# Altium schematic sheet Э2 Jinkono Module Схема электрическая функциональная.SchDoc
size 594 x 420 mm; Author: Гавриленко; CompanyName: OPEN SOURCE; Address1: Address1; Address2: Address2; Address3: Address3; Address4: Address4; SheetTotal: 1; DocumentType: Схема электрическая принципиальная
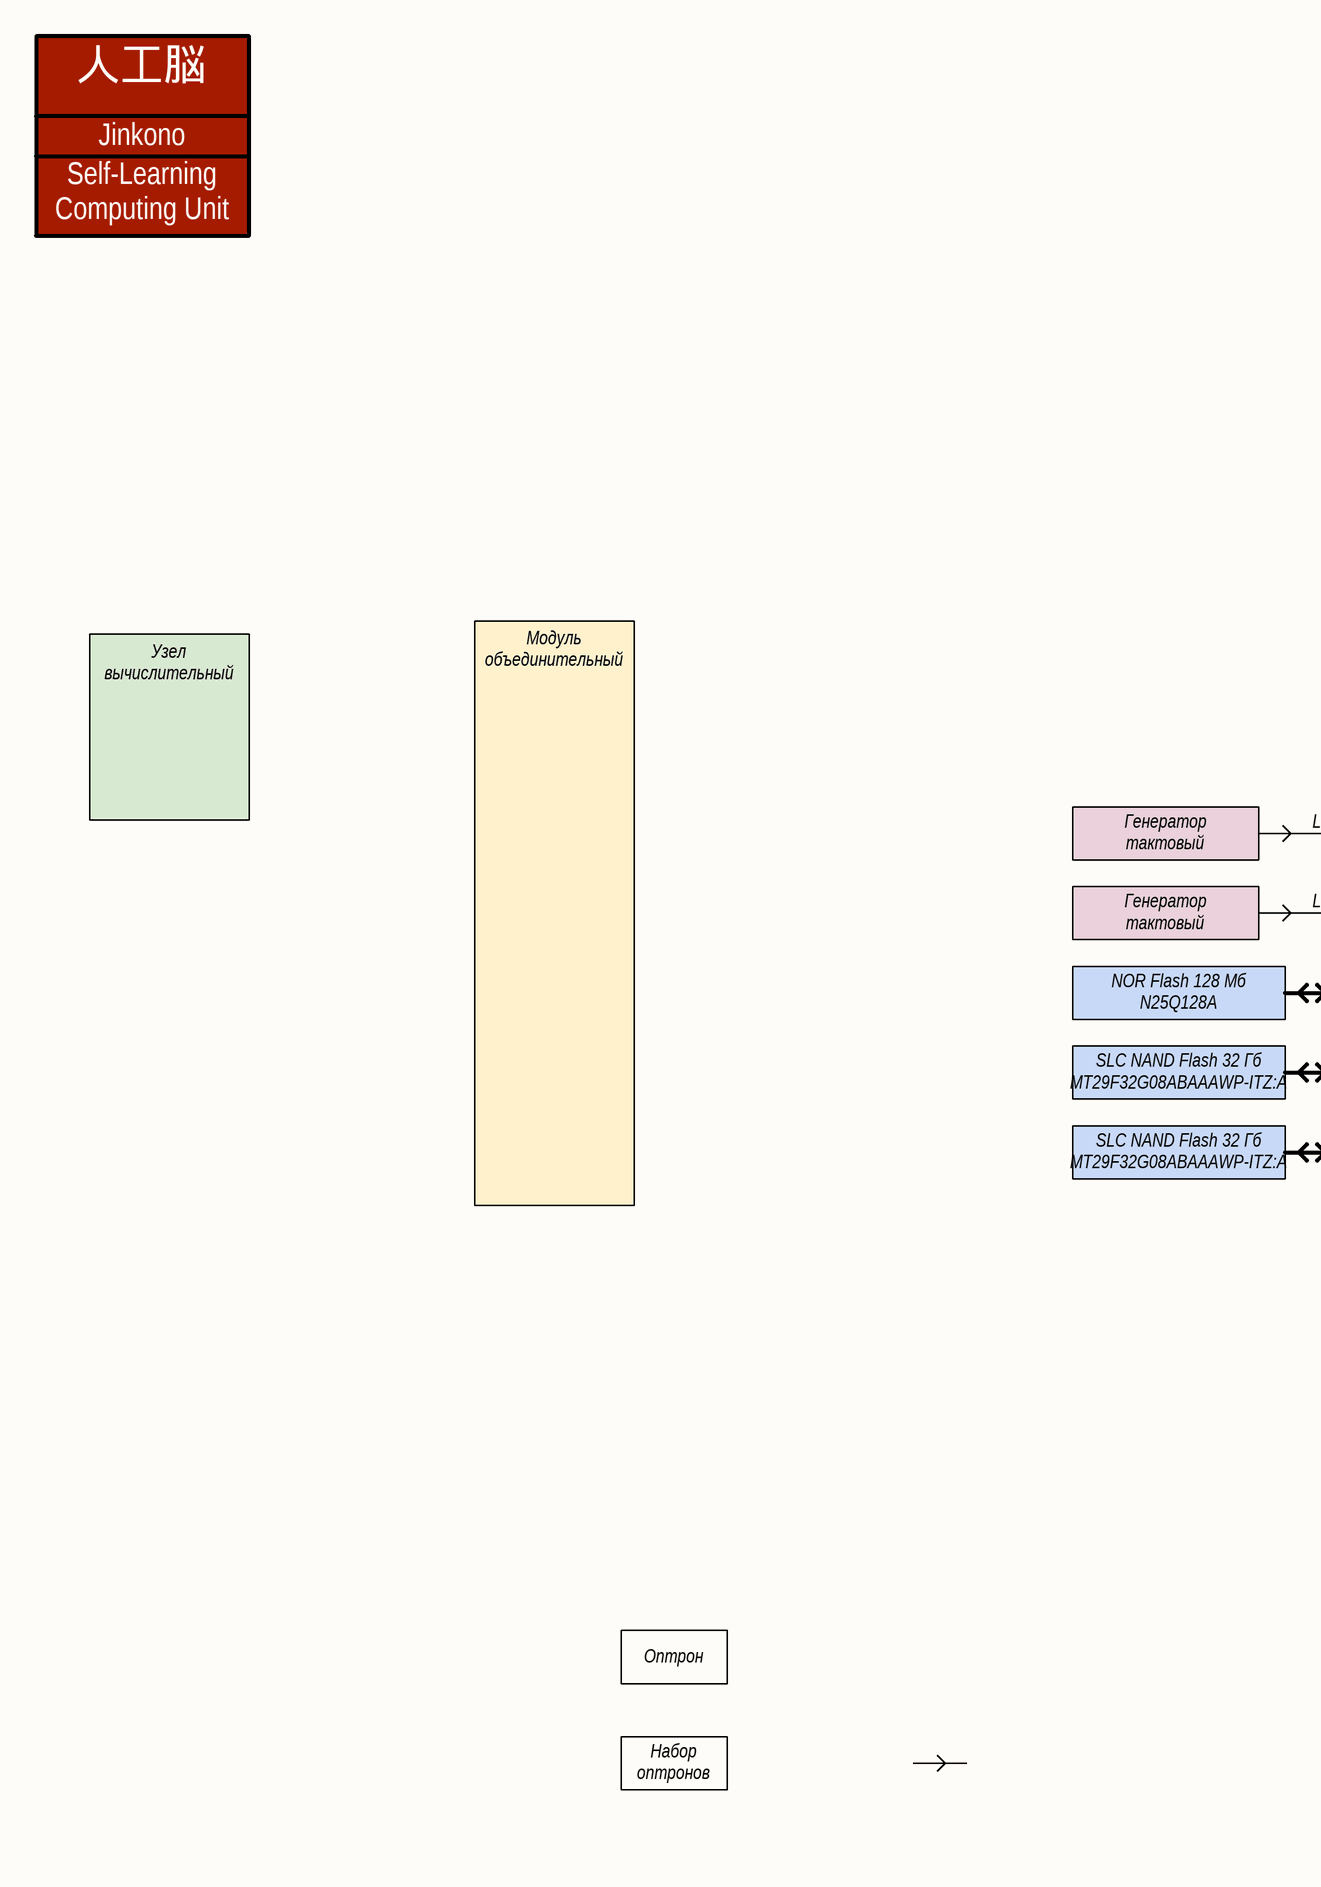
[diagram p0: Э2 Jinkono Module Схема электрическая функциональная.SchDoc, left]
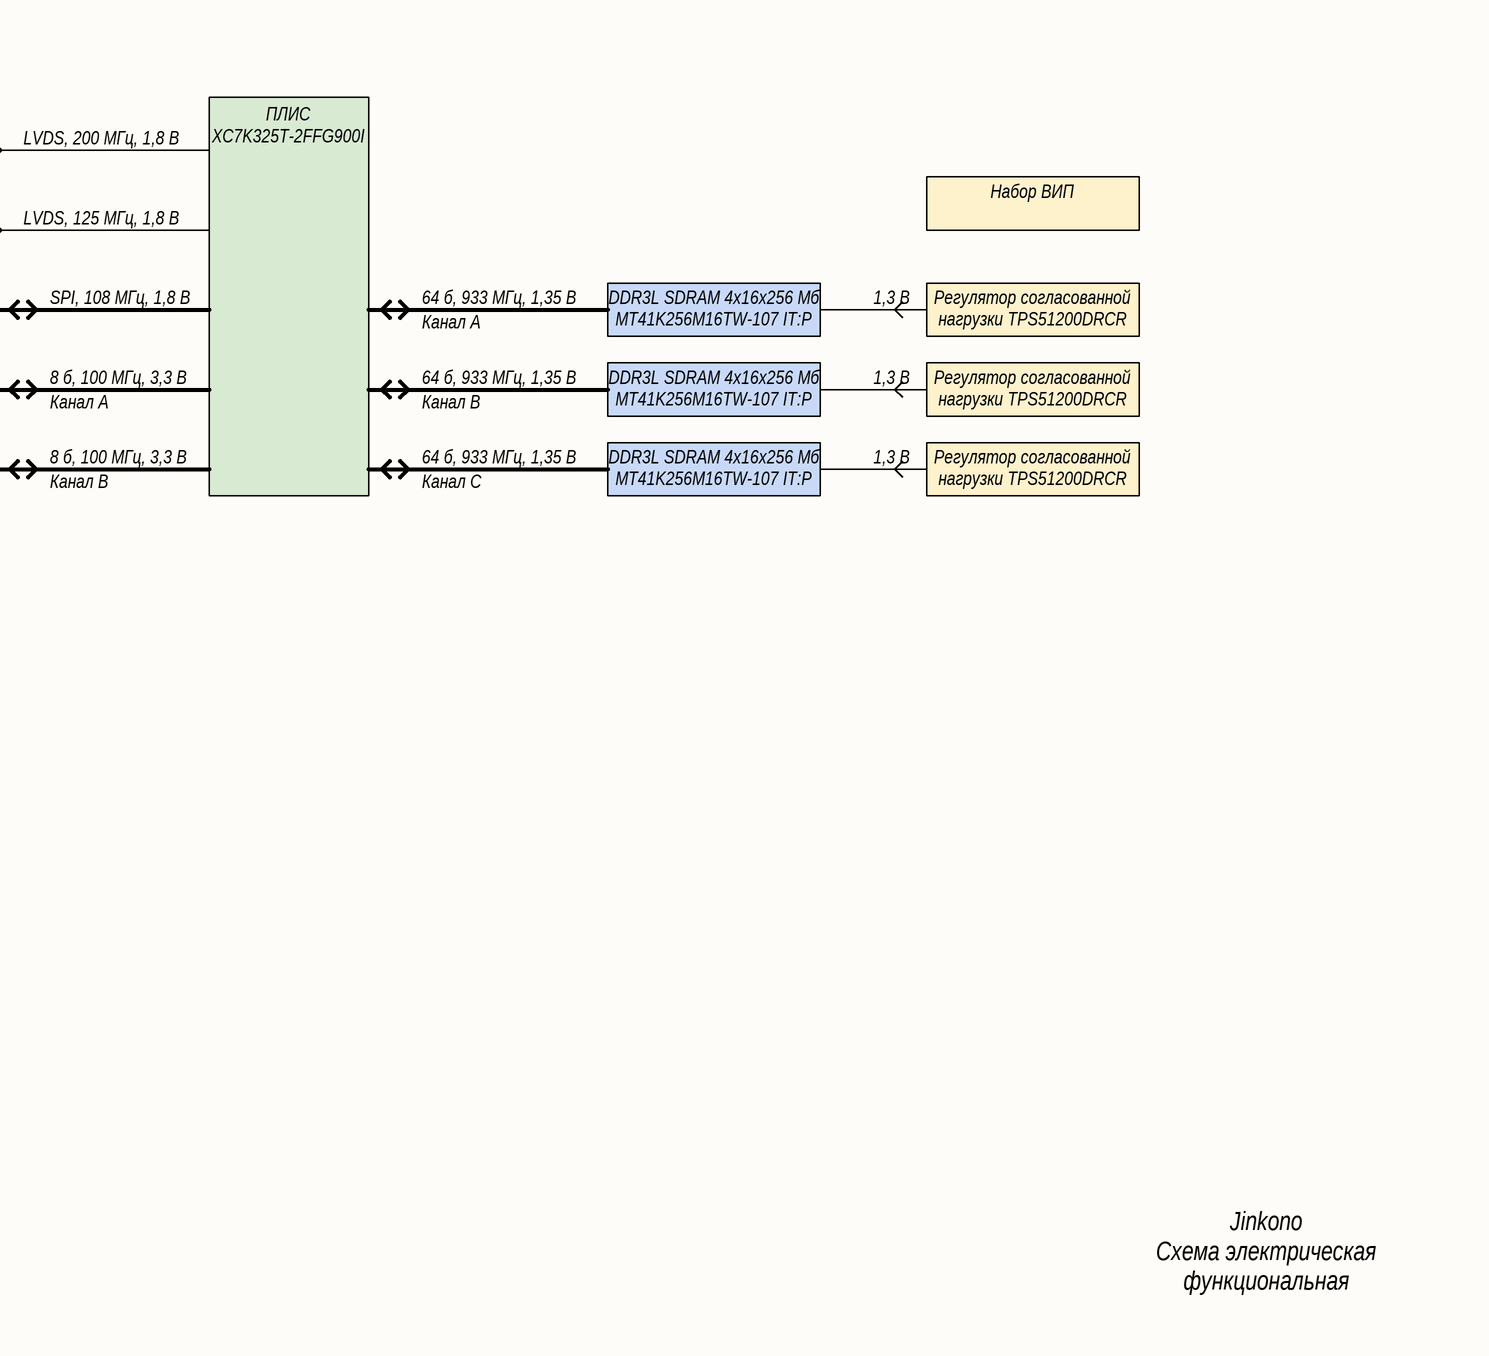
[diagram p1: Э2 Jinkono Module Схема электрическая функциональная.SchDoc, right]

## Notes on the sheet
- 人工脳
- Jinkono
- Self-Learning
  Computing Unit
- Узел
  вычислительный
- Генератор
  тактовый
- LVDS, 200 МГц, 1,8 В
- LVDS, 125 МГц, 1,8 В
- Набор ВИП
- SPI, 108 МГц, 1,8 В
- 64 б, 933 МГц, 1,35 В
- Канал A
- 1,3 В
- NOR Flash 128 Mб
  N25Q128A
- DDR3L SDRAM 4x16x256 Мб
  MT41K256M16TW-107 IT:P
- Регулятор согласованной
  нагрузки TPS51200DRCR
- SLC NAND Flash 32 Гб
  MT29F32G08ABAAAWP-ITZ:A
- 8 б, 100 МГц, 3,3 В
- Канал B
- ПЛИС
  XC7K325T-2FFG900I
- Канал C
- Модуль
  объединительный
- Оптрон
- Набор
  оптронов
- Jinkono
  Схема электрическая
  функциональная
- Перв. примен.
- Справ. №
- Подп. и дата
- Инв. № дубл.
- Взам. инв. №
- Разраб.
- Изм.
- Лист
- № докум.
- Подп.
- Дата
- Лит.
- Масса
- Масштаб
- Пров.
- Т.контр.
- Листов
- Инв. № подл.
- Утв.
- Н.контр.
- 2.106-A2
- Копировал
- Формат А2